# EAGLE design led-controller-shield (EAGLE 7.7.0)
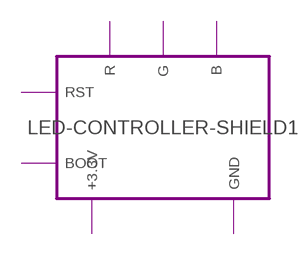
[diagram p0: schematic, sheet 1]

## Module instances
LED-CONTROLLER-SHIELD1 = LED-CONTROLLER-SHIELD

## Library data of the parts

## Module LED-CONTROLLER-SHIELD
Ports: +3.3V(pwr) GND(pwr) R(out) G(out) B(out) BOOT(io) RST(io)
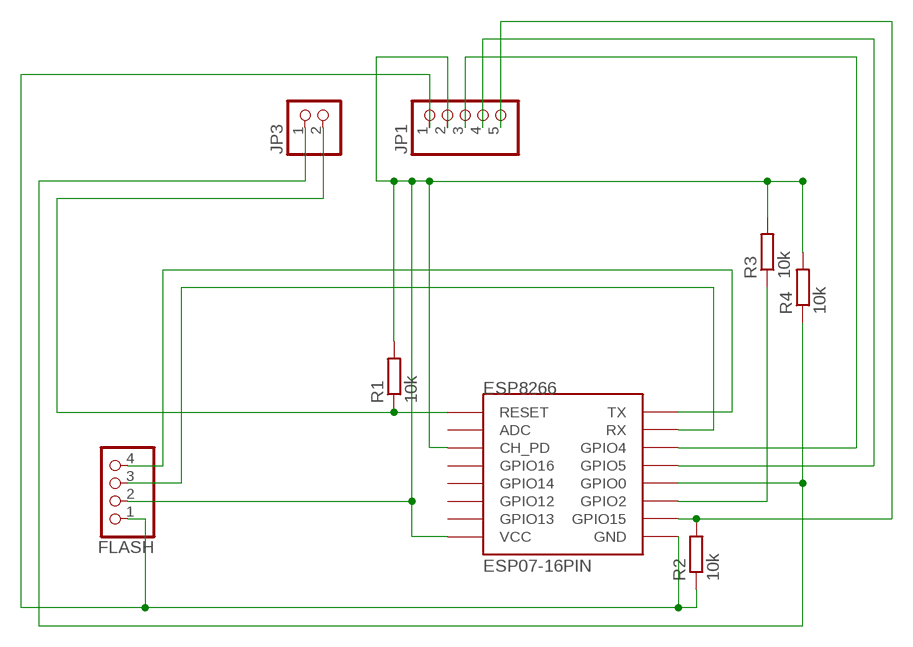
[diagram p1: schematic, module LED-CONTROLLER-SHIELD, sheet 1]

### Parts
ESP8266  ESP07-16PIN  [ESP07-16PIN]
FLASH  PINHD-1X4  [1X04]
JP1  PINHD-1X5  [1X05]
JP3  PINHD-1X2  [1X02]
R1  10k  R-EU_M1206  [M1206]
R2  10k  R-EU_M1206  [M1206]
R3  10k  R-EU_M1206  [M1206]
R4  10k  R-EU_M1206  [M1206]

### Nets
+3.3V: ESP8266.CH_PD ESP8266.VCC FLASH.2 JP1.2 R1.2 R3.2 R4.2
B: ESP8266.GPIO15 JP1.5 R2.2
BOOT: ESP8266.GPIO0 JP3.1 R4.1
G: ESP8266.GPIO5 JP1.4
GND: ESP8266.GND FLASH.1 JP1.1 R2.1
N$6: ESP8266.GPIO2 R3.1
N$8: ESP8266.TX FLASH.4
N$9: ESP8266.RX FLASH.3
R: ESP8266.GPIO4 JP1.3
RST: ESP8266.REST(RESET) JP3.2 R1.1
Unconnected: ESP8266.ADC ESP8266.GPIO12 ESP8266.GPIO13 ESP8266.GPIO14 ESP8266.GPIO16

### Library data of the parts
ESP8266 = esp8266modules:ESP07-16PIN: ESP8266 Wifi module 07 - 16 pins; DIMENSIONS: 22.0 x 16.0 mm; PINS: 16; PITCH: 0.078" / 2 mm
FLASH = pinhead:PINHD-1X4: PIN HEADER
JP1 = pinhead:PINHD-1X5: PIN HEADER
JP3 = pinhead:PINHD-1X2: PIN HEADER
R1-R4 = resistor:R-EU_: RESISTOR, European symbol

## Board
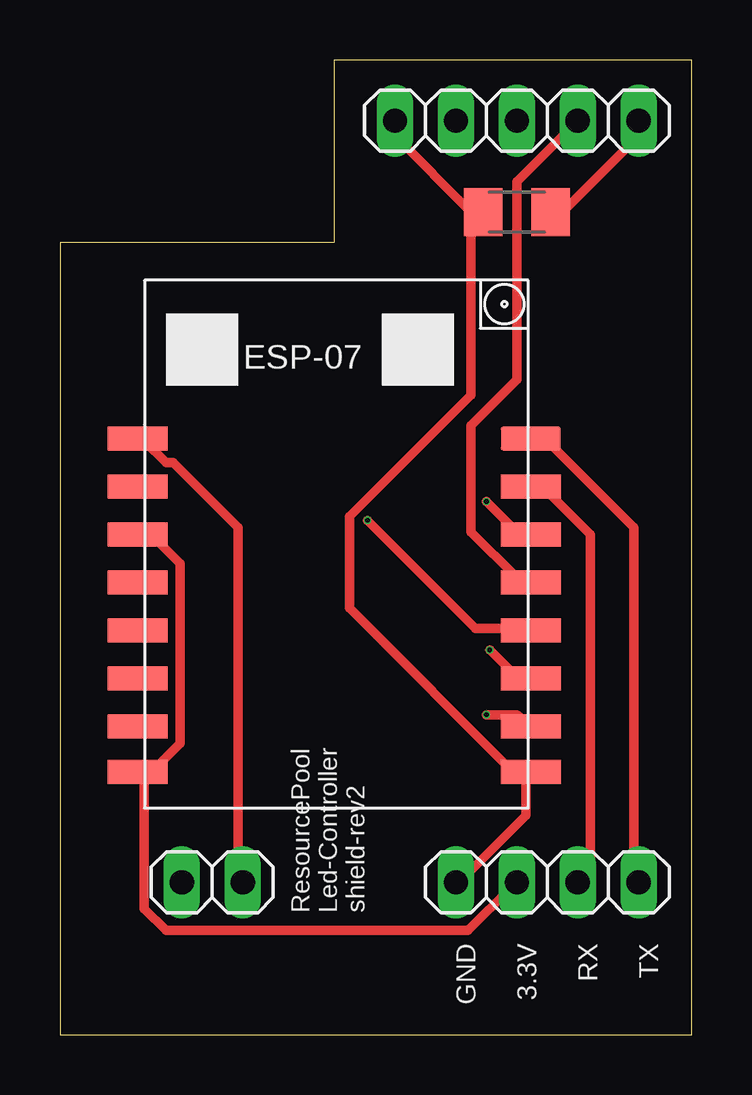
[diagram p2: board, top side]
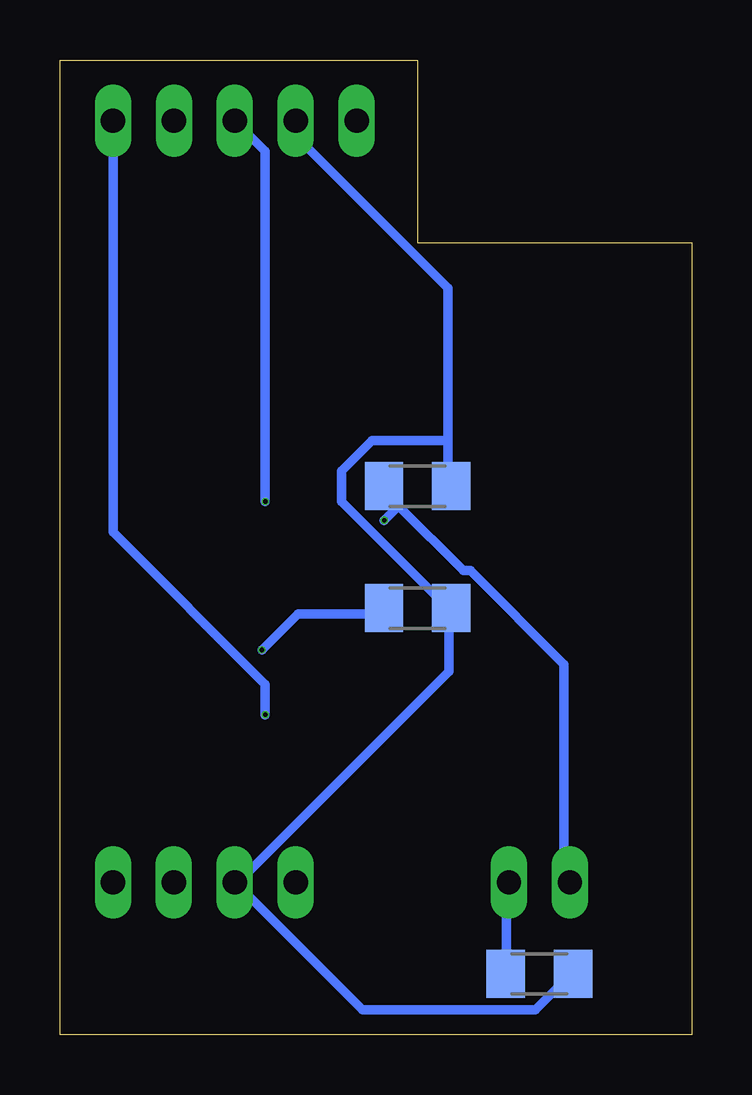
[diagram p3: board, bottom side, seen from below]

Size 26.34 x 40.63 mm. Coordinates in mm from the lower left corner, seen from the top.
Outline: 0,0 26.34,0 26.34,40.63 11.43,40.63 11.43,33.02 0,33.02 0,0
Copper layers (1*16): Top 0.035mm / dielectric 1.5mm / Bottom 0.035mm
Design rules "aisler_go_2layer *": minimum track width 0.4mm, minimum drill 0.2mm, track to track 0.2mm, track to pad 0.2mm, pad to pad 0.2mm, via to via 0.2mm, smd to smd 0.1mm, copper to edge 0.2mm, drill to drill 0.21mm, minimum pad ring 0.25mm, minimum via ring 0.05mm, stop-mask expansion 0.01mm, vias tented up to drill 0mil, thermal gap 10mil

### Footprints (pad centres in the part's own frame; a part is rotated, then mirrored left to right if it is on the bottom)
ESP07-16PIN = smd 2.5 x 1: ADC -8.2,3.8; CH_PD -8.2,1.8; GND 8.2,-8.105; GPIO0 8.2,-2.2; GPIO2 8.2,-4.2; GPIO4 8.2,1.8; GPIO5 8.2,-0.2; GPIO12 -8.2,-4.2; GPIO13 -8.2,-6.2; GPIO14 -8.2,-2.2; GPIO15 8.2,-6.2; GPIO16 -8.2,-0.2; REST -8.2,5.8; RX 8.2,3.8; TX 8.2,5.8; VCC -8.2,-8.105
1X04 = drill 1.016 long: 1 -3.81,0; 2 -1.27,0; 3 1.27,0; 4 3.81,0
1X05 = drill 1.016 long: 1 -5.08,0; 2 -2.54,0; 3 0,0; 4 2.54,0; 5 5.08,0
1X02 = drill 1.016 long: 1 -1.27,0; 2 1.27,0
M1206 = smd 1.6 x 2: 1 -1.4,0; 2 1.4,0

### Placement (x,y rotation side)
LED-CONTROLLER-SHIELD1:ESP8266  ESP07-16PIN  [ESP07-16PIN]  11.43,19.05 0 top
LED-CONTROLLER-SHIELD1:FLASH  [1X04]  20.32,6.35 0 top
LED-CONTROLLER-SHIELD1:JP1  [1X05]  19.05,38.1 0 top
LED-CONTROLLER-SHIELD1:JP3  [1X02]  6.35,6.35 0 top
LED-CONTROLLER-SHIELD1:R1  10k  [M1206]  6.35,2.54 0 bottom
LED-CONTROLLER-SHIELD1:R2  10k  [M1206]  19.05,34.29 0 top
LED-CONTROLLER-SHIELD1:R3  10k  [M1206]  11.43,17.78 0 bottom
LED-CONTROLLER-SHIELD1:R4  10k  [M1206]  11.43,22.86 0 bottom

### Tracks (layer width: path | path; a pad name or v marks a point on that pad's centre or on a via)
LED-CONTROLLER-SHIELD1:+3.3V
  Top 0.4: LED-CONTROLLER-SHIELD1:ESP8266.CH_PD 3.52,21.14 5.02,19.64 5.02,12.14 4.12,11.24 3.52,11.24 LED-CONTROLLER-SHIELD1:ESP8266.VCC 3.52,10.94 3.52,5.24 4.42,4.34 17.02,4.34 18.82,6.14 LED-CONTROLLER-SHIELD1:FLASH.2
  Bottom 0.4: LED-CONTROLLER-SHIELD1:R1.2 5.02,2.54 6.52,1.04 13.72,1.04 18.82,6.14 LED-CONTROLLER-SHIELD1:FLASH.2 18.82,6.44 10.12,15.14 10.12,17.54 LED-CONTROLLER-SHIELD1:R3.2 10.16,17.78 14.6,22.22 14.6,23.49 13.33,24.77 10.16,24.77 | 10.16,24.77 10.16,31.11 16.51,37.47 LED-CONTROLLER-SHIELD1:JP1.2 | 10.16,24.77 10.16,22.86 LED-CONTROLLER-SHIELD1:R4.2
LED-CONTROLLER-SHIELD1:B  (via drill 0.2)
  Top 0.4: LED-CONTROLLER-SHIELD1:JP1.5 24.13,37.47 20.95,34.29 LED-CONTROLLER-SHIELD1:R2.2 | v17.78,13.34 19.05,13.34 LED-CONTROLLER-SHIELD1:ESP8266.GPIO15
  Bottom 0.4: v17.78,13.34 17.78,14.6 24.13,20.95 LED-CONTROLLER-SHIELD1:JP1.5
LED-CONTROLLER-SHIELD1:BOOT  (via drill 0.2)
  Top 0.4: v12.82,21.44 17.32,16.94 19.42,16.94 LED-CONTROLLER-SHIELD1:ESP8266.GPIO0
  Bottom 0.4: 12.22,22.04 9.52,19.34 9.22,19.34 5.32,15.44 5.32,6.44 LED-CONTROLLER-SHIELD1:JP3.1 | 12.22,22.04 12.82,22.64 LED-CONTROLLER-SHIELD1:R4.1 12.22,22.04 | 12.22,22.04 v12.82,21.44
LED-CONTROLLER-SHIELD1:G
  Top 0.4: LED-CONTROLLER-SHIELD1:JP1.4 19.05,35.56 19.05,27.3 17.14,25.4 17.14,20.95 19.05,19.05 LED-CONTROLLER-SHIELD1:ESP8266.GPIO5
LED-CONTROLLER-SHIELD1:GND
  Top 0.4: LED-CONTROLLER-SHIELD1:FLASH.1 16.72,6.44 19.42,9.14 19.42,10.94 LED-CONTROLLER-SHIELD1:ESP8266.GND 19.05,10.79 12.06,17.78 12.06,21.59 17.14,26.67 17.14,34.29 | 17.14,34.29 13.97,37.47 LED-CONTROLLER-SHIELD1:JP1.1 | 17.14,34.29 LED-CONTROLLER-SHIELD1:R2.1
LED-CONTROLLER-SHIELD1:N$6  (via drill 0.2)
  Top 0.4: v17.92,16.04 18.82,15.14 19.42,15.14 LED-CONTROLLER-SHIELD1:ESP8266.GPIO2
  Bottom 0.4: v17.92,16.04 16.42,17.54 13.12,17.54 LED-CONTROLLER-SHIELD1:R3.1
LED-CONTROLLER-SHIELD1:N$8
  Top 0.4: LED-CONTROLLER-SHIELD1:ESP8266.TX 19.72,24.74 20.32,24.74 23.92,21.14 23.92,6.44 LED-CONTROLLER-SHIELD1:FLASH.4
LED-CONTROLLER-SHIELD1:N$9
  Top 0.4: LED-CONTROLLER-SHIELD1:ESP8266.RX 19.72,22.64 20.32,22.64 22.12,20.84 22.12,6.74 21.82,6.44 LED-CONTROLLER-SHIELD1:FLASH.3
LED-CONTROLLER-SHIELD1:R  (via drill 0.2)
  Top 0.4: v17.78,22.22 19.05,20.95 LED-CONTROLLER-SHIELD1:ESP8266.GPIO4
  Bottom 0.4: v17.78,22.22 17.78,36.83 LED-CONTROLLER-SHIELD1:JP1.3
LED-CONTROLLER-SHIELD1:RST
  Top 0.4: LED-CONTROLLER-SHIELD1:ESP8266.REST 3.52,24.74 4.42,23.84 4.72,23.84 7.42,21.14 7.42,6.44 LED-CONTROLLER-SHIELD1:JP3.2
  Bottom 0.4: LED-CONTROLLER-SHIELD1:R1.1 7.72,2.54 7.72,6.14 LED-CONTROLLER-SHIELD1:JP3.2

### Text on the board
tNames: ResourcePool / Led-Controller / shield-rev2 | GND | 3.3V | RX | TX